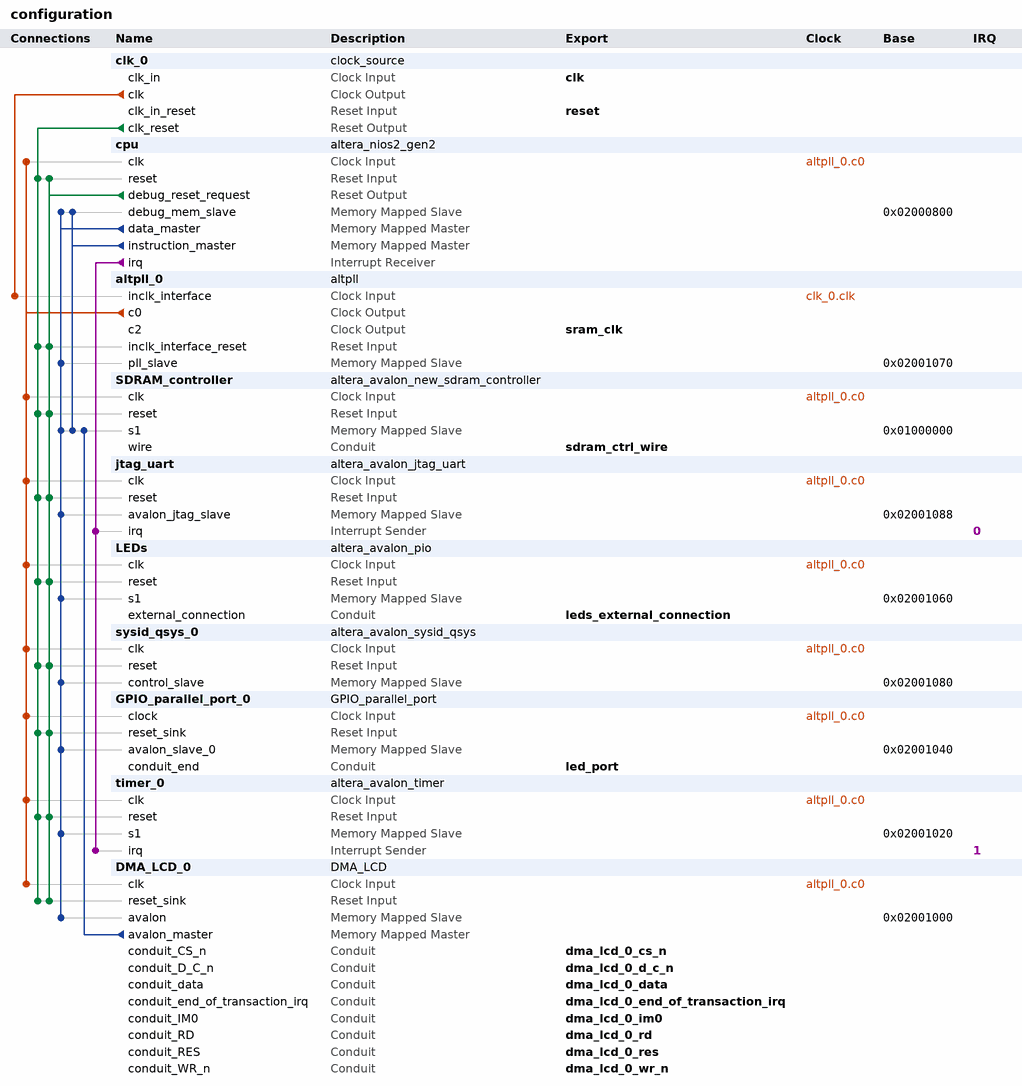
[diagram p0: system contents]
# Platform Designer (Qsys) system configuration, Cyclone IV E EP4CE30F23C7
# Parameters at their usual value, and those the tool derives, are not listed.
package require -exact qsys 18.1
create_system configuration
set_project_property DEVICE_FAMILY {Cyclone IV E}
set_project_property DEVICE EP4CE30F23C7

add_instance clk_0 clock_source 18.1
set_instance_parameter_value clk_0 clockFrequency 50000000

add_instance cpu altera_nios2_gen2 18.1
set_instance_parameter_value cpu dcache_size 2048
set_instance_parameter_value cpu exceptionSlave SDRAM_controller.s1
set_instance_parameter_value cpu icache_size 4096
set_instance_parameter_value cpu impl Fast
set_instance_parameter_value cpu resetSlave SDRAM_controller.s1

add_instance altpll_0 altpll 18.1
set_instance_parameter_value altpll_0 CLK0_DIVIDE_BY 1
set_instance_parameter_value altpll_0 CLK0_MULTIPLY_BY 1
set_instance_parameter_value altpll_0 CLK2_DIVIDE_BY 1
set_instance_parameter_value altpll_0 CLK2_DUTY_CYCLE 50
set_instance_parameter_value altpll_0 CLK2_MULTIPLY_BY 1
set_instance_parameter_value altpll_0 CLK2_PHASE_SHIFT 0
set_instance_parameter_value altpll_0 INCLK0_INPUT_FREQUENCY 20000
set_instance_parameter_value altpll_0 PORT_ARESET PORT_UNUSED
set_instance_parameter_value altpll_0 PORT_LOCKED PORT_UNUSED
set_instance_parameter_value altpll_0 PORT_clk1 PORT_UNUSED
set_instance_parameter_value altpll_0 PORT_clk2 PORT_USED
set_instance_parameter_value altpll_0 PORT_clk3 PORT_UNUSED

add_instance SDRAM_controller altera_avalon_new_sdram_controller 18.1
set_instance_parameter_value SDRAM_controller TAC 5.5
set_instance_parameter_value SDRAM_controller TRCD 20.0
set_instance_parameter_value SDRAM_controller TRP 20.0
set_instance_parameter_value SDRAM_controller casLatency 3
set_instance_parameter_value SDRAM_controller columnWidth 9
set_instance_parameter_value SDRAM_controller dataWidth 16
set_instance_parameter_value SDRAM_controller generateSimulationModel false
set_instance_parameter_value SDRAM_controller model single_Micron_MT48LC4M32B2_7_chip
set_instance_parameter_value SDRAM_controller numberOfBanks 4
set_instance_parameter_value SDRAM_controller numberOfChipSelects 1
set_instance_parameter_value SDRAM_controller powerUpDelay 100.0
set_instance_parameter_value SDRAM_controller refreshPeriod 15.625
set_instance_parameter_value SDRAM_controller rowWidth 12

add_instance jtag_uart altera_avalon_jtag_uart 18.1
set_instance_parameter_value jtag_uart simInteractiveOptions NO_INTERACTIVE_WINDOWS

add_instance LEDs altera_avalon_pio 18.1
set_instance_parameter_value LEDs direction Output
set_instance_parameter_value LEDs width 8

add_instance sysid_qsys_0 altera_avalon_sysid_qsys 18.1
set_instance_parameter_value sysid_qsys_0 id 0

add_instance GPIO_parallel_port_0 GPIO_parallel_port 1.0

add_instance timer_0 altera_avalon_timer 18.1
set_instance_parameter_value timer_0 fixedPeriod true
set_instance_parameter_value timer_0 period 10
set_instance_parameter_value timer_0 periodUnits MSEC

add_instance DMA_LCD_0 DMA_LCD 1.0

# connections
add_connection altpll_0.c0 cpu.clk clock
add_connection altpll_0.c0 DMA_LCD_0.clk clock
add_connection altpll_0.c0 GPIO_parallel_port_0.clock clock
add_connection altpll_0.c0 jtag_uart.clk clock
add_connection altpll_0.c0 LEDs.clk clock
add_connection altpll_0.c0 SDRAM_controller.clk clock
add_connection altpll_0.c0 sysid_qsys_0.clk clock
add_connection altpll_0.c0 timer_0.clk clock
add_connection clk_0.clk altpll_0.inclk_interface clock
add_connection clk_0.clk_reset altpll_0.inclk_interface_reset reset
add_connection clk_0.clk_reset cpu.reset reset
add_connection clk_0.clk_reset DMA_LCD_0.reset_sink reset
add_connection clk_0.clk_reset GPIO_parallel_port_0.reset_sink reset
add_connection clk_0.clk_reset jtag_uart.reset reset
add_connection clk_0.clk_reset LEDs.reset reset
add_connection clk_0.clk_reset SDRAM_controller.reset reset
add_connection clk_0.clk_reset sysid_qsys_0.reset reset
add_connection clk_0.clk_reset timer_0.reset reset
add_connection cpu.debug_reset_request altpll_0.inclk_interface_reset reset
add_connection cpu.debug_reset_request cpu.reset reset
add_connection cpu.debug_reset_request DMA_LCD_0.reset_sink reset
add_connection cpu.debug_reset_request GPIO_parallel_port_0.reset_sink reset
add_connection cpu.debug_reset_request jtag_uart.reset reset
add_connection cpu.debug_reset_request LEDs.reset reset
add_connection cpu.debug_reset_request SDRAM_controller.reset reset
add_connection cpu.debug_reset_request sysid_qsys_0.reset reset
add_connection cpu.debug_reset_request timer_0.reset reset
add_connection cpu.data_master altpll_0.pll_slave avalon
set_connection_parameter_value cpu.data_master/altpll_0.pll_slave baseAddress 0x02001070
add_connection cpu.data_master cpu.debug_mem_slave avalon
set_connection_parameter_value cpu.data_master/cpu.debug_mem_slave baseAddress 0x02000800
add_connection cpu.data_master DMA_LCD_0.avalon avalon
set_connection_parameter_value cpu.data_master/DMA_LCD_0.avalon baseAddress 0x02001000
add_connection cpu.data_master GPIO_parallel_port_0.avalon_slave_0 avalon
set_connection_parameter_value cpu.data_master/GPIO_parallel_port_0.avalon_slave_0 baseAddress 0x02001040
add_connection cpu.data_master jtag_uart.avalon_jtag_slave avalon
set_connection_parameter_value cpu.data_master/jtag_uart.avalon_jtag_slave baseAddress 0x02001088
add_connection cpu.data_master LEDs.s1 avalon
set_connection_parameter_value cpu.data_master/LEDs.s1 baseAddress 0x02001060
add_connection cpu.data_master SDRAM_controller.s1 avalon
set_connection_parameter_value cpu.data_master/SDRAM_controller.s1 baseAddress 0x01000000
add_connection cpu.data_master sysid_qsys_0.control_slave avalon
set_connection_parameter_value cpu.data_master/sysid_qsys_0.control_slave baseAddress 0x02001080
add_connection cpu.data_master timer_0.s1 avalon
set_connection_parameter_value cpu.data_master/timer_0.s1 baseAddress 0x02001020
add_connection cpu.instruction_master cpu.debug_mem_slave avalon
set_connection_parameter_value cpu.instruction_master/cpu.debug_mem_slave baseAddress 0x02000800
add_connection cpu.instruction_master SDRAM_controller.s1 avalon
set_connection_parameter_value cpu.instruction_master/SDRAM_controller.s1 baseAddress 0x01000000
add_connection DMA_LCD_0.avalon_master SDRAM_controller.s1 avalon
set_connection_parameter_value DMA_LCD_0.avalon_master/SDRAM_controller.s1 baseAddress 0x01000000
add_connection cpu.irq jtag_uart.irq interrupt
set_connection_parameter_value cpu.irq/jtag_uart.irq irqNumber 0
add_connection cpu.irq timer_0.irq interrupt
set_connection_parameter_value cpu.irq/timer_0.irq irqNumber 1

# exported interfaces
add_interface clk clock sink
set_interface_property clk EXPORT_OF clk_0.clk_in
add_interface dma_lcd_0_cs_n conduit end
set_interface_property dma_lcd_0_cs_n EXPORT_OF DMA_LCD_0.conduit_CS_n
add_interface dma_lcd_0_d_c_n conduit end
set_interface_property dma_lcd_0_d_c_n EXPORT_OF DMA_LCD_0.conduit_D_C_n
add_interface dma_lcd_0_data conduit end
set_interface_property dma_lcd_0_data EXPORT_OF DMA_LCD_0.conduit_data
add_interface dma_lcd_0_end_of_transaction_irq conduit end
set_interface_property dma_lcd_0_end_of_transaction_irq EXPORT_OF DMA_LCD_0.conduit_end_of_transaction_irq
add_interface dma_lcd_0_im0 conduit end
set_interface_property dma_lcd_0_im0 EXPORT_OF DMA_LCD_0.conduit_IM0
add_interface dma_lcd_0_rd conduit end
set_interface_property dma_lcd_0_rd EXPORT_OF DMA_LCD_0.conduit_RD
add_interface dma_lcd_0_res conduit end
set_interface_property dma_lcd_0_res EXPORT_OF DMA_LCD_0.conduit_RES
add_interface dma_lcd_0_wr_n conduit end
set_interface_property dma_lcd_0_wr_n EXPORT_OF DMA_LCD_0.conduit_WR_n
add_interface led_port conduit end
set_interface_property led_port EXPORT_OF GPIO_parallel_port_0.conduit_end
add_interface leds_external_connection conduit end
set_interface_property leds_external_connection EXPORT_OF LEDs.external_connection
add_interface reset reset sink
set_interface_property reset EXPORT_OF clk_0.clk_in_reset
add_interface sdram_ctrl_wire conduit end
set_interface_property sdram_ctrl_wire EXPORT_OF SDRAM_controller.wire
add_interface sram_clk clock source
set_interface_property sram_clk EXPORT_OF altpll_0.c2

set_interconnect_requirement {$system} qsys_mm.clockCrossingAdapter HANDSHAKE
set_interconnect_requirement {$system} qsys_mm.enableEccProtection FALSE
set_interconnect_requirement {$system} qsys_mm.insertDefaultSlave FALSE
set_interconnect_requirement {$system} qsys_mm.maxAdditionalLatency 1

save_system configuration.qsys
